# Altium schematic sheet Sensors.SchDoc: Sensors
size A3; SheetNumber: 9; SheetTotal: 9
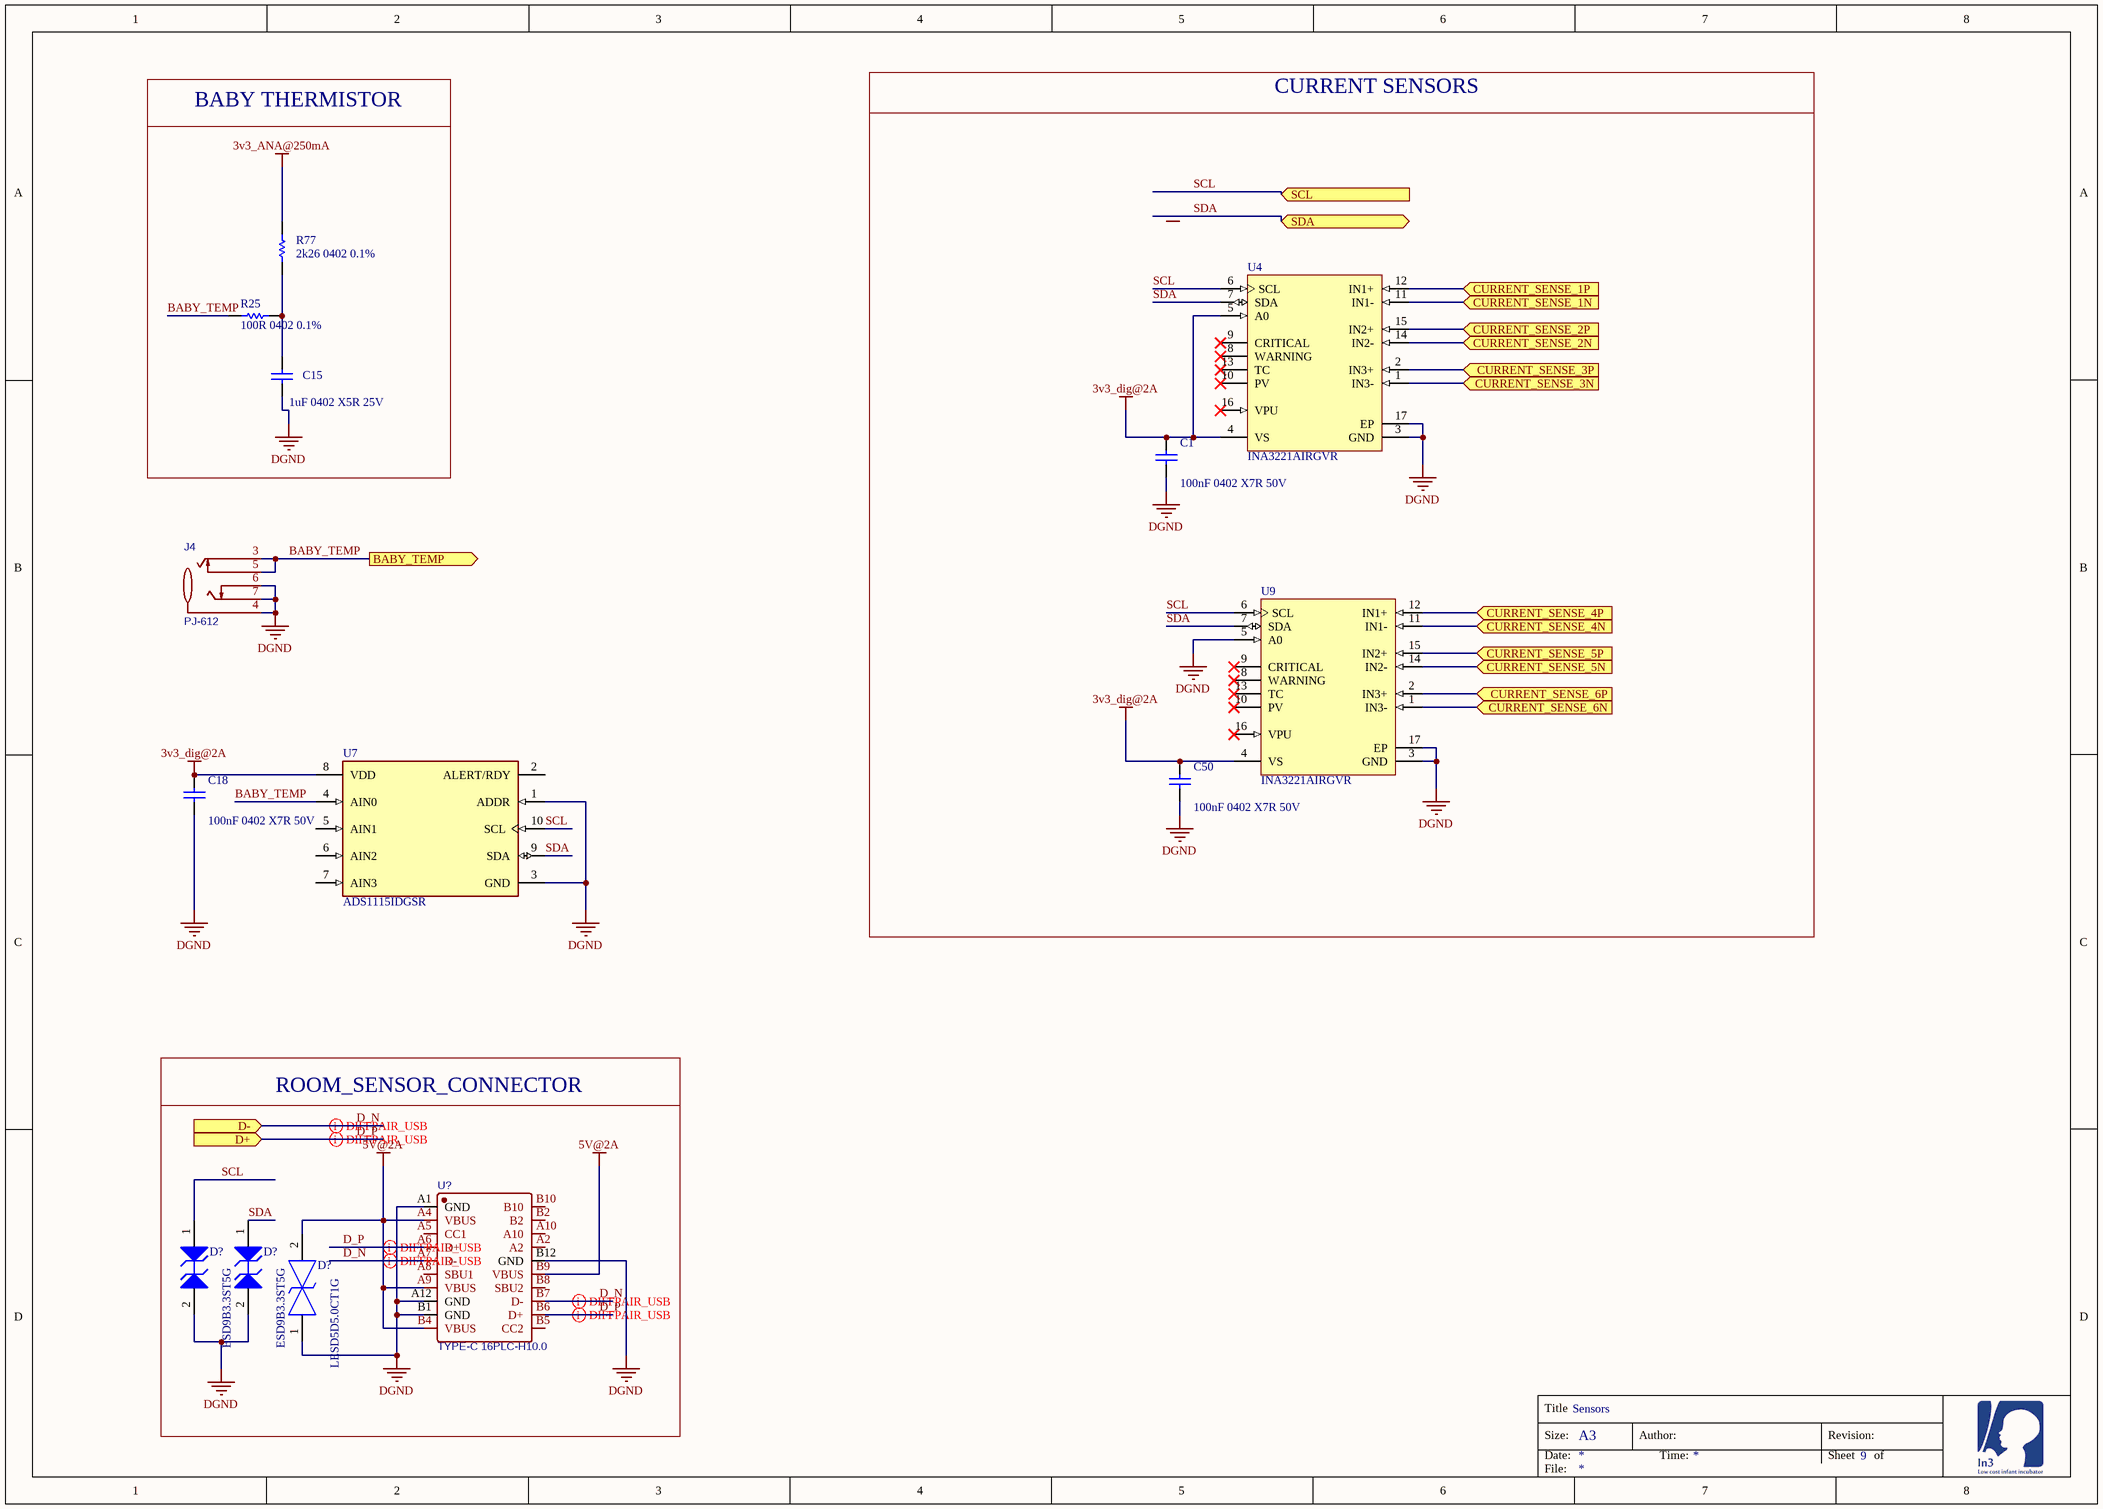
[diagram p0: Sensors.SchDoc]

## Parts
(Parts that share a designator on the sheet are numbered #1, #2 ... from top to bottom, then left to right.)
C1  100nF 0402 X7R 50V  [CAPC1005X55X25NL5T10]
C15  1uF 0402 X5R 25V  [CAPC1005X55X25NL5T10]
C18  100nF 0402 X7R 50V  [CAPC1005X55X25NL5T10]
C50  100nF 0402 X7R 50V  [CAPC1005X55X25NL5T10]
D?#1  ESD9B3.3ST5G  [ONSC-SOD-923-2-514AB-01_V]
D?#2  ESD9B3.3ST5G  [ONSC-SOD-923-2-514AB-01_V]
D?#3  LESD5D5.0CT1G  [LESD5D50CT1G]
J4  PJ-612  [AUDIO-TH_PJ-612]
R25  100R 0402 0.1%  [RESC1005X40X25ML05T10]
R77  2k26 0402 0.1%  [RESC1005X40X25ML05T10]
U4  INA3221AIRGVR  [RGV0016A_V]
U7  ADS1115IDGSR  [FP-DGS0010A-IPC_B]
U9  INA3221AIRGVR  [RGV0016A_V]
U?  TYPE-C 16PLC-H10.0  [TYPE-C-TH_16PLC-H10.0]

## Blocks framed on the sheet
BABY THERMISTOR: C15 R25 R77
CURRENT SENSORS: C1 C50 U4 U9
ROOM_SENSOR_CONNECTOR: D?#1-D?#3 U?

## Ports
BABY_TEMP (out), CURRENT_SENSE_1N (in), CURRENT_SENSE_1P (in), CURRENT_SENSE_2N (in), CURRENT_SENSE_2P (in), CURRENT_SENSE_3N (in), CURRENT_SENSE_3P (in), CURRENT_SENSE_4N (in), CURRENT_SENSE_4P (in), CURRENT_SENSE_5N (in), CURRENT_SENSE_5P (in), CURRENT_SENSE_6N (in), CURRENT_SENSE_6P (in), D+ (in), D- (in), SCL (in), SDA (bidir)

## Nets
3v3_ANA@250mA: R77.2
3v3_dig@2A: C1.2 C18.2 C50.2 U4.4(VS) U4.5(A0) U7.8(VDD) U9.4(VS)
5V@2A: D?#3.2 U?.A4(VBUS) U?.A9(VBUS) U?.B4(VBUS) U?.B9(VBUS)
DGND: C1.1 C15.1 C18.1 C50.1 D?#1.2(A2) D?#2.2(A2) D?#3.1 J4.4 J4.6 J4.7 U4.3(GND) U4.17(EP) U7.1(ADDR) U7.3(GND) U9.3(GND) U9.5(A0) U9.17(EP) U?.A1(GND) U?.A12(GND) U?.B1(GND) U?.B12(GND)
BABY_TEMP: J4.3 J4.5 R25.2 U7.4(AIN0) ; port BABY_TEMP
CURRENT_SENSE_1N: U4.11(IN1-) ; port CURRENT_SENSE_1N
CURRENT_SENSE_1P: U4.12(IN1+) ; port CURRENT_SENSE_1P
CURRENT_SENSE_2N: U4.14(IN2-) ; port CURRENT_SENSE_2N
CURRENT_SENSE_2P: U4.15(IN2+) ; port CURRENT_SENSE_2P
CURRENT_SENSE_3N: U4.1(IN3-) ; port CURRENT_SENSE_3N
CURRENT_SENSE_3P: U4.2(IN3+) ; port CURRENT_SENSE_3P
CURRENT_SENSE_4N: U9.11(IN1-) ; port CURRENT_SENSE_4N
CURRENT_SENSE_4P: U9.12(IN1+) ; port CURRENT_SENSE_4P
CURRENT_SENSE_5N: U9.14(IN2-) ; port CURRENT_SENSE_5N
CURRENT_SENSE_5P: U9.15(IN2+) ; port CURRENT_SENSE_5P
CURRENT_SENSE_6N: U9.1(IN3-) ; port CURRENT_SENSE_6N
CURRENT_SENSE_6P: U9.2(IN3+) ; port CURRENT_SENSE_6P
D_N: U?.A7(D-) U?.B7(D-) ; port D-
D_P: U?.A6(D+) U?.B6(D+) ; port D+
SCL: D?#1.1(A1) U4.6(SCL) U7.10(SCL) U9.6(SCL) ; port SCL
SDA: D?#2.1(A1) U4.7(SDA) U7.9(SDA) U9.7(SDA) ; port SDA
NetC15_2: C15.2 R25.1 R77.1

Not connected (* = marked no-connect by the designer): U4 8(WARNING)* 9(CRITICAL)* 10(PV)* 13(TC)* 16(VPU)*; U7 2(ALERT/RDY) 5(AIN1) 6(AIN2) 7(AIN3); U9 8(WARNING)* 9(CRITICAL)* 10(PV)* 13(TC)* 16(VPU)*; U? A2 A5(CC1) A8(SBU1) A10 B2 B5(CC2) B8(SBU2) B10

## Layout directives
differential pair; differential pair class USB: D_N, D_P

## Notes on the sheet
- Title
- Size:
- Date:
- A3
- Author:
- Time:
- Revision:
- Sheet
- of
- File:

## Library data of the parts
C1 C15 C18 C50 = CMP-1662-00020-1: ComponentLink2Description: Datasheet; ComponentLink2URL: http://psearch.en.murata.com/capacitor/product/GRM155R60J105KE19%23.pdf; ComponentLink1Description: Manufacturer URL; ComponentLink1URL: http://www.murata.com/
  C1 C18 C50: LCSC_PN: C77020
  C15: LCSC_PN: C77009
D?#1 D?#2 = CMP-1063-00120-1: Transient Voltage Suppressor, Micro-Packaged Diode for ESD Protection, 2-Pin SOD-923, Pb-Free, Tape and Reel; Manufacturer: On Semiconductor; Number of Lines: 1; V(BR) Min (V): 5; VRWM Max (V): 3.3; Direction: Bidirectional; ComponentLink3URL: http://www.onsemi.com/pub_link/Collateral/514AB.PDF; PartNumber: ESD9B3.3ST5G; PackageVersion: Rev. C, 03/2011; Mounting Technology: Surface Mount; PackageReference: SOD-923-2-514AB-01; RoHS: Pb-Free; DatasheetVersion: Rev. 2; ComponentLink1URL: http://www.onsemi.com/; PackageDescription: 2-Pin SOD, Body 0.8 x 0.6 mm; ComponentLink3Description: Package Specification; ComponentLink2URL: http://www.onsemi.cn/pub_link/Collateral/ESD9B-D.PDF; IR Max (uA): 1; Packing: Tape and Reel; ComponentLink2Description: Datasheet; ComponentLink1Description: Manufacturer URL; LCSC_PN: C96512
D?#3 = LESD5D5.0CT1G: TVS Diode (Bi-directional); Manufacturer_Name: LRC; Height: 0.7mm; Manufacturer_Part_Number: LESD5D5.0CT1G; LCSC_PN: C383211
J4 = PJ-612: Manufacturer: HOOYA(皓宇电子); Contributor: LCSC; Supplier: LCSC; Supplier Part: C309284; Manufacturer Part: PJ-612; JLCPCB Part Class: Extended Part; spicePre: J; spiceSymbolName: PJ-612; LCSC_PN: C309284
R25 R77 = CMP-2002-07472-1
  R25: LCSC_PN: C106233
  R77: LCSC_PN: C852697
U4 U9 = CMP-0704-00001-2: Triple Channel Shunt and Bus Voltage Monitor, 120 dB, 2.7 to 5.5 V, -40 to 125 degC, 16-Pin VQFN (RGV), Green (RoHS & no Sb/Br), Tape and Reel; Manufacturer: Texas Instruments; Rating: Catalog; Quiescent Current (Typ): 350 uA; Gain Error (max): 0.25%; CMR (Typ): 120 dB; Offset Voltage (max): +/- 80 uV; Gain: 1 V/V; Voltage Input Range (Bus): 0 to 26 V; ComponentLink2Description: Datasheet; PackageDescription: 16-Pin Quad Flat No-lead Package, Body 4 x 4 mm, Pitch 0.65 mm; ComponentLink3URL: http://www.ti.com/lit/ds/symlink/ina3221.pdf; PartNumber: INA3221AIRGVR; Operating Supply Range: 2.7 to 5.5 V; DatasheetVersion: SBOS576A; Temperature Range: -40 to 125 degC; ComponentLink1Description: Manufacturer URL; ComponentLink1URL: http://www.ti.com/; RoHS: TRUE; ComponentLink3Description: Package Specification; Packing: Tape and Reel; Mounting Technology: Surface Mount; ComponentLink2URL: http://www.ti.com/lit/ds/symlink/ina3221.pdf; PackageVersion: SBOS576A; PackageReference: RGV0016A; LCSC_PN: C181255
U7 = CMP-0003-00385-3: IC ADC 16BIT SIGMA-DELTA 10VSSOP; Max Supply Voltage (DC): 5.5V; Resolution: 16b; Interface: I2C; Number of Inputs: 4; Sampling Rate: 860S/s; Integral Nonlinearity (INL): 1LSB; Min Supply Voltage: 2V; Polarity: Bipolar; Conversion Rate: 0.86KS/s; Supply Type: Single; Number of Converters: 1; Number of Bits: 16; Power Dissipation: 900uW; Case/Package: VSSOP; Contact Plating: Gold; RoHS Compliant: Yes; Max Operating Temperature: 125°C; Lead Free: Lead Free; Package Quantity: 2500; Series: -; Min Supply Voltage (DC): 2V; REACH SVHC: No SVHC; Packaging: Tape and Reel; Max Supply Voltage: 5.5V; Radiation Hardening: No; Min Operating Temperature: -40°C; Number of Pins: 10; Number of A/D Converters: 1; LCSC_PN: C37593
U? = TYPE-C 16PLC-H10.0: Manufacturer: SHOU HAN(首韩); Contributor: lcsc; Supplier: LCSC; Supplier Part: C3151747; Manufacturer Part: TYPE-C 16PLC-H10.0; JLCPCB Part Class: Extended Part; spicePre: U; spiceSymbolName: TYPE-C 16PLC-H10.0; LCSC_PN: C3151747